# Altium project MZCAT_commutation_board_RPI.PrjPcb
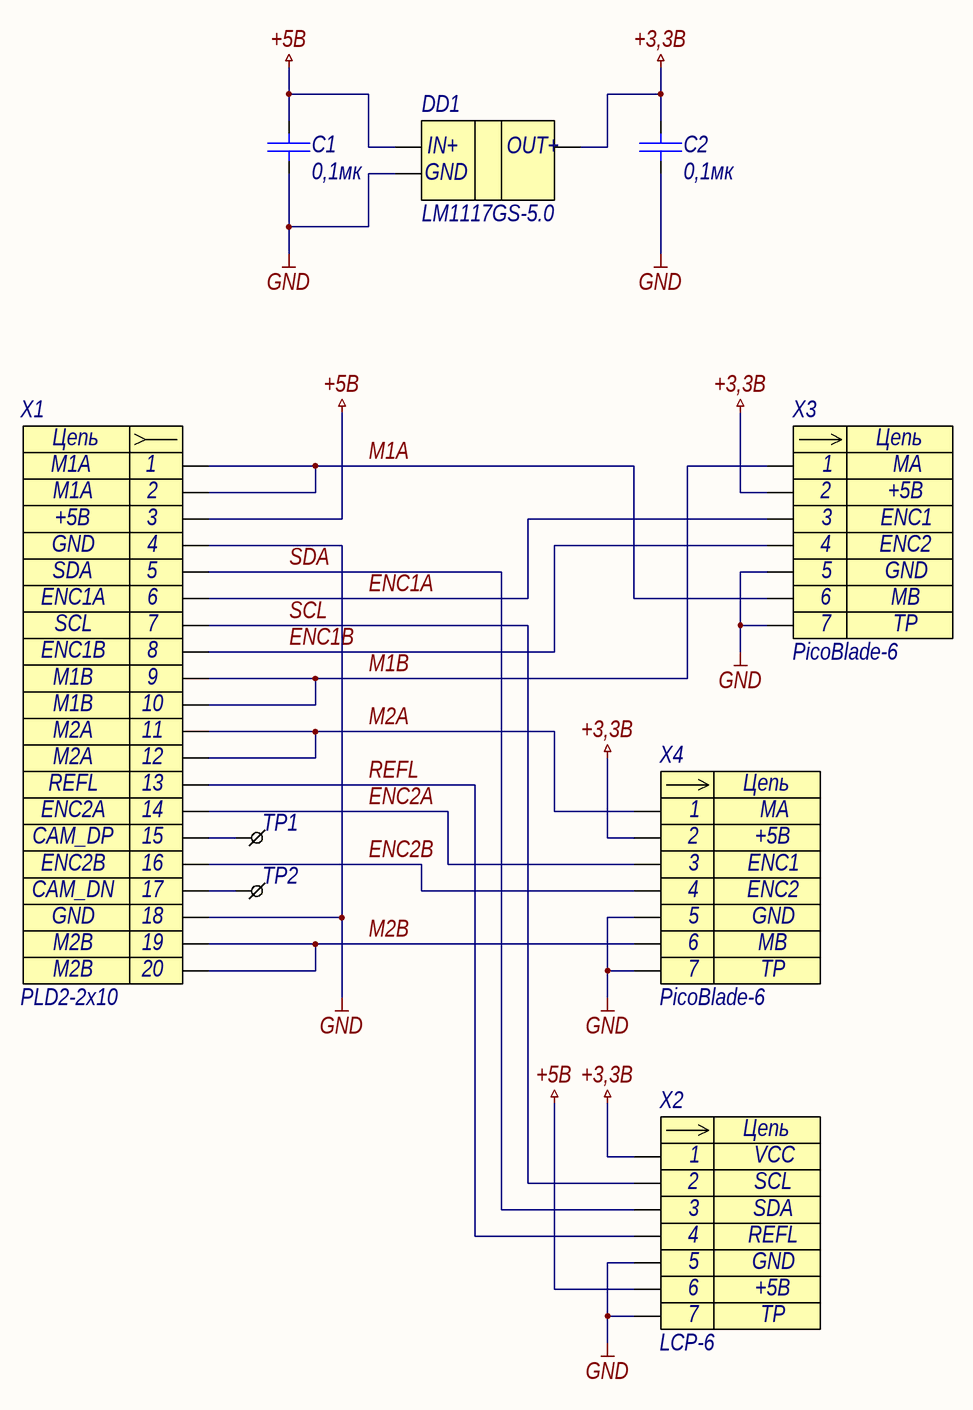
[diagram p0: MZCAT_commutation_board.SchDoc]
1 sheet, 9 parts. Net scope: global (net labels, ports and power ports of the same name join across sheets).
Board file: MZCAT_commutation_board.PcbDoc

## Sheet MZCAT_commutation_board.SchDoc
size 594 x 420 mm; SheetNumber: 1; SheetTotal: 1

### Parts
DD1  LM1117GS-5.0  [SOT-223]
TP1  CAM_DP  [TP_0,6X1]  (value not drawn)  (no BOM)
TP2  CAM_DN  [TP_0,6X1]  (value not drawn)  (no BOM)
X1  PLD2-2x10  [PLS 2.00 10x2 SMT]
X2  LCP-6  [LCP 6 pin]
X3  PicoBlade-6  [PicoBlade-6 SMD]
X4  PicoBlade-6  [PicoBlade-6 SMD]
С1  0,1мк  [C0603]
С2  0,1мк  [C0603]

### Nets
+3,3В: DD1.2 X2.1 X3.2 X4.2 С2.2
+5В: DD1.3 X1.3 X2.6 С1.2
GND: DD1.1 X1.4 X1.18 X2.0 X2.5 X3.0 X3.5 X4.0 X4.5 С1.1 С2.1
ENC1A: X1.6 X3.3
ENC1B: X1.8 X3.4
ENC2A: X1.14 X4.3
ENC2B: X1.16 X4.4
M1A: X1.1 X1.2 X3.6
M1B: X1.9 X1.10 X3.1
M2A: X1.11 X1.12 X4.1
M2B: X1.19 X1.20 X4.6
REFL: X1.13 X2.4
SCL: X1.7 X2.2
SDA: X1.5 X2.3
NetTP1_1: TP1.1 X1.15
NetTP2_1: TP2.1 X1.17

### Notes on the sheet
- Перв. примен.
- Справ. №
- Подп. и дата
- Инв. № дубл.
- Нормоконтроль:
- Взам. инв. №
- Изм.
- Лист
- № докум.
- Подп.
- Дата
- Лит.
- Масса
- Масштаб
- Т.контр.
- Пров.
- Разраб.
- Листов
- Разработал:
- Инв. № подл.
- Н.контр.
- Утв.
- Копировал
- Формат
- А2
- (in symbol Header_6) Цепь; 7
- (in symbol PLS 10 x 2) Цепь

### Library data of the parts
DD1 = LM1117-3.3: LM1117GS-3.3; Contact_1: IN+; Contact_2: GND; Contact_3: OUT+; Name: LM1117GS-5.0
TP1 TP2 = TESTPOINT_HOLE
  TP1: Name: CAM_DP
  TP2: Name: CAM_DN
X1 = PLS 10 x 2: Contact_1: M1A; Contact_3: +5В; Contact_4: GND; Contact_5: SDA; Contact_6: ENC1A; Contact_7: SCL; Contact_8: ENC1B; Contact_9: M1B; Contact_11: M2A; Contact_13: REFL; Contact_14: ENC2A; Contact_15: CAM_DP; Contact_16: ENC2B; Contact_17: CAM_DN; Contact_19: M2B; Contact_2: M1A; Contact_10: M1B; Contact_12: M2A; Contact_18: GND; Contact_20: M2B; Name: PLD2-2x10
X2 = Header_6: Разъем - 6 конт. мама; Contact_1: VCC; Contact_2: SCL; Contact_3: SDA; Contact_4: REFL; Contact_5: GND; Contact_6: +5В; Contact_7: TP; Name: LCP-6
X3 X4 = Header_6: Разъем - 6 конт. мама; Contact_1: MA; Contact_2: +5В; Contact_3: ENC1; Contact_4: ENC2; Contact_5: GND; Contact_6: MB; Contact_7: TP; Name: PicoBlade-6
С1 С2 = Кер. конденсатор: Value: 0,1мк